# Altium schematic sheet Sheet2.SchDoc
size A4; SheetNumber: 2; SheetTotal: 2
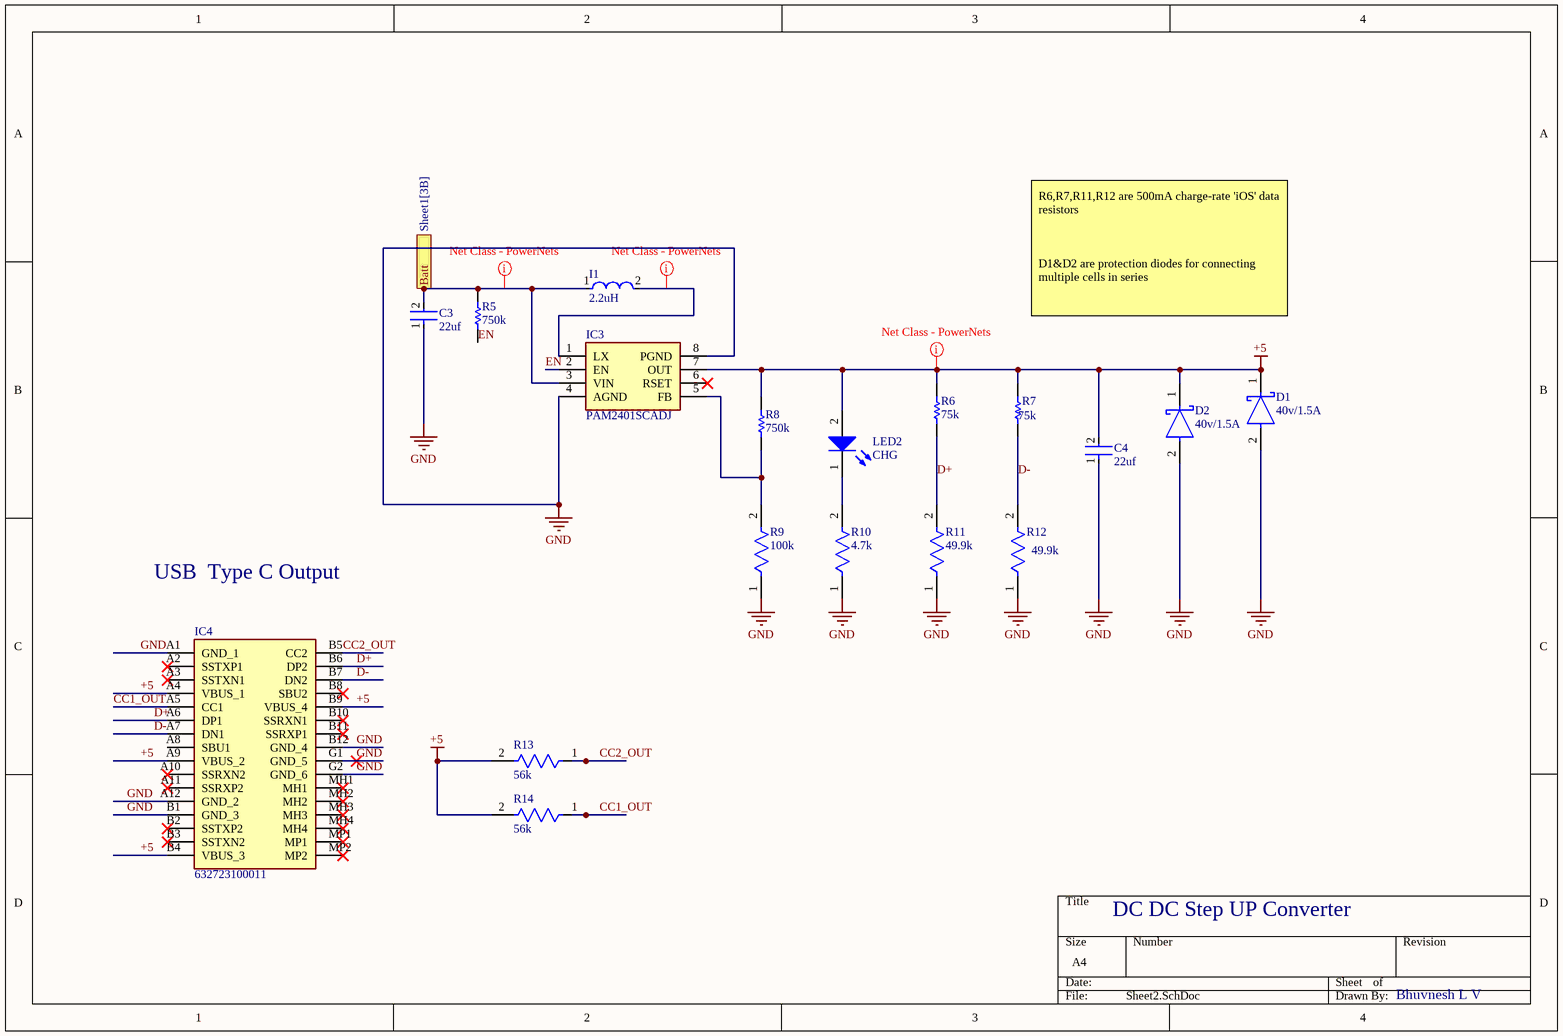
[diagram p0: Sheet2.SchDoc]

## Parts
C3  22uf  [FP-GRM21B-0_15-MFG]
C4  22uf  [FP-GRM21B-0_15-MFG]
D1  40v/1.5A  [FP-95400-MFG]
D2  40v/1.5A  [FP-95400-MFG]
I1  2.2uH  [FP-LQM2HPN_G0-IPC_C]
IC3  PAM2401SCADJ  [SOP65P490X110-8N]
IC4  632723100011  [632723100011]
LED2  CHG  [WL-SMCW_0805_150080xx75000]
R5  750k  [RESC2013X50X30LL20T20]
R6  75k  [RESC2013X60X40NL20T25]
R7  75k  [RESC2013X60X40NL20T25]
R8  750k  [RESC2013X50X30LL20T20]
R9  100k  [FP-RC0805-0_6-IPC_C]
R10  4.7k  [FP-CRCW0805-e3-IPC_B]
R11  49.9k  [FP-CRCW0805-e3-IPC_C]
R12  49.9k  [FP-CRCW0805-e3-IPC_C]
R13  56k  [FP-CRCW0805-e3-IPC_B]
R14  56k  [FP-CRCW0805-e3-IPC_B]

## Ports
Batt (see Sheet1[3B])

## Nets
+5: C4.2 D1.1(C) D2.1(C) IC3.7(OUT) IC4.A4(VBUS_1) IC4.A9(VBUS_2) IC4.B4(VBUS_3) IC4.B9(VBUS_4) LED2.2(A) R6.2 R7.2 R8.2 R13.2 R14.2
GND: C3.1 C4.1 D1.2(A) D2.2(A) IC3.4(AGND) IC3.8(PGND) IC4.A1(GND_1) IC4.A12(GND_2) IC4.B1(GND_3) IC4.B12(GND_4) IC4.G1(GND_5) IC4.G2(GND_6) R9.1 R10.1 R11.1 R12.1
Batt: C3.2 I1.1 IC3.3(VIN) R5.2 ; port Batt
CC1_OUT: IC4.A5(CC1) R14.1
CC2_OUT: IC4.B5(CC2) R13.1
D+: IC4.A6(DP1) IC4.B6(DP2) R6.1 R11.2
D-: IC4.A7(DN1) IC4.B7(DN2) R7.1 R12.2
EN: IC3.2(EN) R5.1
NetI1_2: I1.2 IC3.1(LX)
NetIC3_5: IC3.5(FB) R8.1 R9.2
NetLED2_1: LED2.1(K) R10.2

Not connected (* = marked no-connect by the designer): IC3 6(RSET)*; IC4 A2(SSTXP1)* A3(SSTXN1)* A8(SBU1) A10(SSRXN2)* A11(SSRXP2)* B2(SSTXP2)* B3(SSTXN2)* B8(SBU2)* B10(SSRXN1)* B11(SSRXP1)* MH1* MH2* MH3* MH4* MP1* MP2*

## Layout directives
net class PowerNets: +5, Batt, NetI1_2

## Notes on the sheet
- R6,R7,R11,R12 are 500mA charge-rate 'iOS' data resistors
  D1&D2 are protection diodes for connecting multiple cells in series
  Output current 1A 5V
  0.9V to 4.75V Batt Input Range (3.7 to 4.2V expected)
- USB  Type C Output
- DC DC Step UP Converter
- Bhuvnesh L V

## Library data of the parts
C3 C4 = CMP-2007-03385-2: Chip Multilayer Ceramic Capacitors for General Purpose, 0805, 22uF, X5R, 15%, 20%, 6.3V; Material: Ceramic; Max Operating Temperature: 85°C; Voltage: 6.3V; Min Operating Temperature: -55°C; Case/Package: 0805; Thickness: 0.053inch; Dielectric: X5R; Packaging: Tape and Reel; Depth: 1.25mm; Termination: SMD/SMT; Voltage Rating (DC): 6.3V; Radiation Hardening: No; Tolerance: 20%; Mount: Surface Mount; Lead Free: Lead Free; Package Quantity: 1; REACH SVHC: No SVHC; Voltage Rating: 6.3V; Capacitance: 22uF; Length: 2mm; Case Code (Imperial): 0805; Case Code (Metric): 2012; Width: 0.049inch; Height: 1.25mm
D1 D2 = CMP-02539-000025-1: DIODE SCHOTTKY 40V 1.5A SMA; Manufacturer: Vishay; Manufacturer Part Number: VS-15MQ040NTRPBF; Standoff Height: 0mm; Capacitance: 134pF; Peak Reverse Current: 0.5mA; Max Junction Temp: +150°C; Value: 134pF; Max Surge Forward Current: 140A; RoHS: TRUE; Lead Free: Yes; Octopart: https://octopart.com/vs-15mq040ntrpbf-vishay-44340959; Max Repetitive Reverse Voltage: 40V; Device Class L1: Discrete Semiconductors; ComponentLink2URL: http://www.vishay.com/docs/94141/vs-15mq040ntrpbf.pdf; Reverse Voltage: 40V; ComponentLink2Description: Datasheet; Forward Current: 1.5A; Temperature: -40°C to +150°C; Digikey Description: DIODE SCHOTTKY 40V 1.5A SMA; Height: 2.29mm; Category: Diode; Footprint Url: http://www.vishay.com/docs/95400/sma.pdf; Device Class L2: Diodes; Device Class L3: Schottky Diodes; Mouser Description: Schottky Diodes & Rectifiers 2.1 Amp 40 Volt; Automotive: No; Package: 95400; Temperature Range Low: -40°C; Temperature Range High: +150°C
I1 = CMP-1662-00028-2: Multilayer Type Inductor for Power Lines, 1008 (2520), 2.2μH, 20%, 0.1Ω, 1.3A; Core Material: Ferrite; DC Resistance (DCR): 100mR; Test Frequency: 1MHz; Self Resonant Frequency: 40MHz; Shielding: Shielded; Depth: 2.2mm; Length: 2.5mm; Max DC Current: 1.3A; Military Standard: Not; Current Rating: 1.3A; Termination: SMD/SMT; Radiation Hardening: No; Tolerance: 20%; Height: 1.2mm; Case Code (Metric): 2520; DC Current: 1.3A; Inductance Tolerance: 20%; Packaging: Tape and Reel; Width: 2mm; REACH SVHC: No SVHC; Mount: Surface Mount; Inductance: 2.2uH; Max Operating Temperature: 125°C; Lead Free: Lead Free; Case/Package: 1008; Case Code (Imperial): 1008; Series: LQM2HP_G0; Height - Seated (Max): 0.039inch; Package Quantity: 3000; Min Operating Temperature: -55°C
IC3 = PAM2401SCADJ: Integrated Circuit; Manufacturer_Name: Diodes Incorporated; Datasheet Link: https://www.diodes.com//assets/Datasheets/PAM2401.pdf; Height: 1.1mm; Manufacturer_Part_Number: PAM2401SCADJ; Mouser Part Number: 621-PAM2401SCADJ; Mouser Price/Stock: https://www.mouser.co.uk/ProductDetail/Diodes-Incorporated/PAM2401SCADJ?qs=Ay79KZaUeZCprHtLIDXq%252BQ%3D%3D; Arrow Part Number: PAM2401SCADJ; Arrow Price/Stock: https://www.arrow.com/en/products/pam2401scadj/diodes-incorporated?region=nac
IC4 = 632723100011: Integrated Circuit; Manufacturer_Name: Wurth Elektronik; Datasheet Link: https://componentsearchengine.com/Datasheets/1/632723100011.pdf; Height: 3.11mm; Manufacturer_Part_Number: 632723100011; Mouser Part Number: 710-632723100011; Mouser Price/Stock: https://www.mouser.co.uk/ProductDetail/Wurth-Elektronik/632723100011?qs=NK6InXoXhq4o62C9ULXLjQ%3D%3D
LED2 = CMP-1426-00008-7: Led, Blue, 470 Nm, 3.2 V, 30 Ma, 145 Mcd Rohs Compliant: Yes; Dominant Wavelength: 470nm; Max Junction Temperature (Tj): 95°C; Power Dissipation: 105mW; Peak Wavelength: 465nm; Max Reverse Voltage (DC): 5V; Forward Current: 100mA; Test Current: 20mA; Luminous Intensity: 145mcd; Lens Style: Clear, Rectangular; Viewing Angle: 140°; Forward Voltage: 3.2V; Color: Blue; Height: 700µm; Case Code (Imperial): 0805; Width: 1.25mm; REACH SVHC: Unknown; Case/Package: 0805; Lead Free: Lead Free; Mount: Surface Mount; Packaging: Tape and Reel; RoHS: Compliant; Reverse Voltage: 5V; Min Operating Temperature: -40°C; Case Code (Metric): 2012; Wavelength: 470nm; Max Operating Temperature: 85°C; Length: 2mm
R5 R8 = CMP-2001-04102-1: Manufacturer: Vishay Dale; Part Number: CRCW0805750KFKEA
R6 R7 = CMP-2001-00668-1: Manufacturer: Panasonic; Part Number: ERA6AEB753V
R9 = CMP-2100-03668-5: RES 100K OHM 1% 1/8W 0805; Power Rating: 125mW; Temperature Coefficient: 100ppm/°C; Voltage Rating (DC): 150V; Resistance: 100kR; Package Quantity: 1; Case/Package: 0805; Lead Pitch: 0.4mm; Case Code (Imperial): 0805; Construction: Rectangular; Number of Terminations: 2; RoHS Compliant: Yes; Max Power Dissipation: 125mW; Tolerance: 1%; Max Operating Temperature: 155°C; Resistance Tolerance: 1%; Lead Free: Lead Free; Packaging: Tape and Reel; Resistor Type: Thick Film; Min Operating Temperature: -55°C; Case Code (Metric): 2012; Series: RC; Technology: THICK FILM; Voltage Rating: 150V; Termination: SMD/SMT; Width: 0.049inch; Number of Pins: 2; Features: Moisture Resistant; Military Standard: Not; Length: 0.079inch; Depth: 1.25mm; Size Code: 0805; Height: 0.024inch
R10 = CMP-2100-03615-2: RES Thick Film, 4.7kΩ, 1%, 0.125W, 100ppm/°C, 0805; Max Power Dissipation: 125mW; Resistance: 4.7kR; Voltage Rating: 150V; Termination: SMD/SMT; Weight: 0.000194oz; Case/Package: 0805; Number of Terminations: 2; Min Operating Temperature: -55°C; Case Code (Metric): 2012; Package Quantity: 10; Depth: 1.25mm; Military Standard: Not; Composition: Thick Film; Radiation Hardening: No; Contact Plating: Tin; Height: 0.45mm; Power Rating: 125mW; Features: Automotive AEC-Q200; Tolerance: 1%; Packaging: Tape and Reel; Max Operating Temperature: 155°C; Length: 2mm; Case Code (Imperial): 0805; Voltage Rating (DC): 150V; Width: 1.25mm; Temperature Coefficient: 100ppm/°C; Lead Free: Lead Free
R11 R12 = CMP-2001-03952-2: RES Thick Film, 49.9kΩ, 1%, 0.125W, 100ppm/°C, 0805; Resistance: 49.9kR; Power Rating: 125mW; Voltage Rating (DC): 150V; Contact Plating: Tin; Case Code (Imperial): 0805; Package Quantity: 10; Termination: SMD/SMT; Length: 2mm; Width: 0.049inch; Case Code (Metric): 2012; Temperature Coefficient: 100ppm/°C; Tolerance: 1%; Depth: 1.25mm; Mount: Surface Mount; Lead Free: Lead Free; Min Operating Temperature: -55°C; Case/Package: 0805; Number of Terminations: 2; Composition: Thick Film; Height: 0.45mm; Voltage Rating: 150V; Max Power Dissipation: 125mW; Features: Automotive AEC-Q200; Military Standard: Not; Radiation Hardening: No; Max Operating Temperature: 155°C; Weight: 0.000194oz; Packaging: Tape and Reel
R13 R14 = CMP-2001-04015-2: RES Thick Film, 56kΩ, 1%, 0.125W, 100ppm/°C, 0805; Resistance: 56kR; Power Rating: 125mW; Voltage Rating: 150V; Depth: 1.25mm; Contact Plating: Tin; Package Quantity: 10; Min Operating Temperature: -55°C; Case/Package: 0805; Packaging: Tape and Reel; Lead Free: Lead Free; Case Code (Imperial): 0805; Tolerance: 1%; Height: 0.45mm; Max Operating Temperature: 155°C; Case Code (Metric): 2012; Number of Pins: 2; Width: 1.25mm; Mount: Surface Mount; Voltage Rating (DC): 150V; Max Power Dissipation: 125mW; Weight: 0.000194oz; Termination: SMD/SMT; Length: 2mm; Radiation Hardening: No; Composition: Thick Film; Features: Automotive AEC-Q200; Number of Terminations: 2; Temperature Coefficient: 100ppm/°C; Military Standard: Not